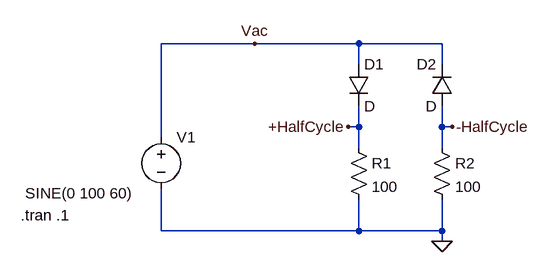
[diagram p0: schematic ltspice_diode_WEST.asc]
ltspice_diode_WEST.asc, the LTspice schematic file:
Version 4.1
SHEET 1 880 680
WIRE 208 -16 64 -16
WIRE 368 -16 208 -16
WIRE 496 -16 368 -16
WIRE 368 16 368 -16
WIRE 496 16 496 -16
WIRE 368 112 368 80
WIRE 368 112 352 112
WIRE 496 112 496 80
WIRE 512 112 496 112
WIRE 64 128 64 -16
WIRE 368 144 368 112
WIRE 496 144 496 112
WIRE 64 272 64 208
WIRE 368 272 368 224
WIRE 368 272 64 272
WIRE 496 272 496 224
WIRE 496 272 368 272
WIRE 496 288 496 272
FLAG 208 -16 Vac
FLAG 496 288 0
FLAG 352 112 +HalfCycle
FLAG 512 112 -HalfCycle
SYMBOL voltage 64 112 R0
WINDOW 3 -209 102 Left 2
WINDOW 123 0 0 Left 0
WINDOW 39 0 0 Left 0
SYMATTR Value SINE(0 100 60)
SYMATTR InstName V1
SYMBOL diode 352 16 R0
SYMATTR InstName D1
SYMBOL res 352 128 R0
SYMATTR InstName R1
SYMATTR Value 100
SYMBOL diode 512 80 R180
WINDOW 0 24 64 Left 2
WINDOW 3 24 0 Left 2
SYMATTR InstName D2
SYMBOL res 480 128 R0
SYMATTR InstName R2
SYMATTR Value 100
TEXT -152 248 Left 2 !.tran .1

The netlist it stands for:
* ltspice_diode_WEST.asc
V1 Vac 0 SINE(0 100 60)
D1 Vac +HalfCycle D
R1 +HalfCycle 0 100
D2 -HalfCycle Vac D
R2 -HalfCycle 0 100
.model D D
.lib standard.dio
.tran .1
.backanno
.end